# Altium schematic sheet WikiTFT-2.0.SchDoc
size A4
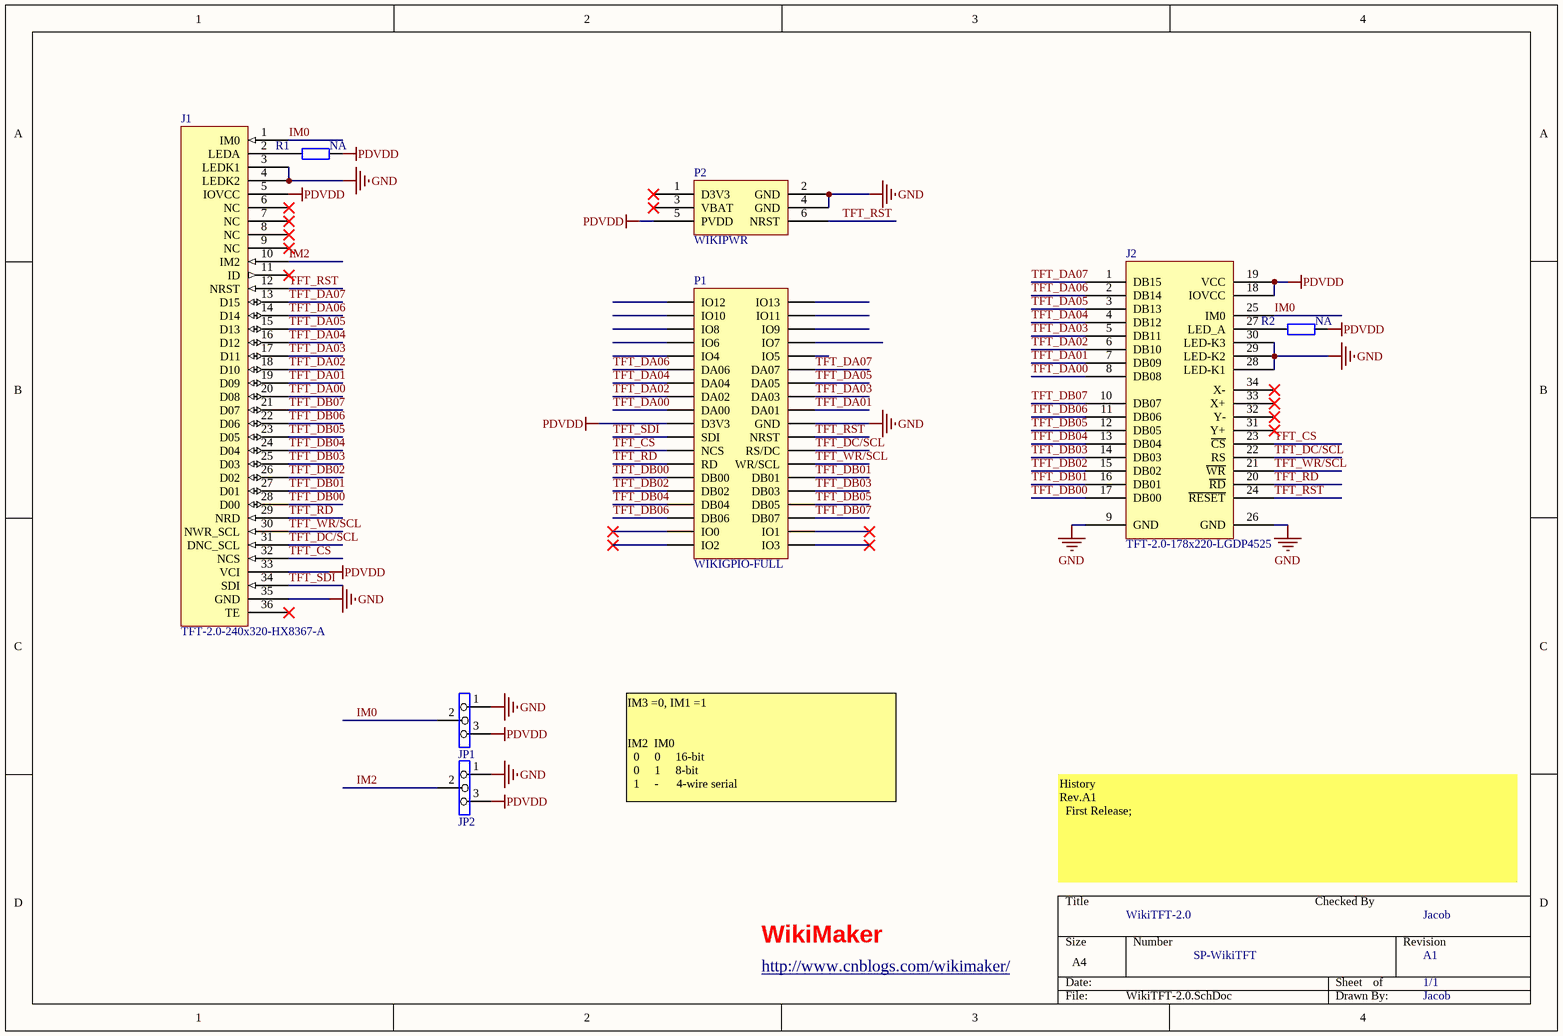
[diagram p0: WikiTFT-2.0.SchDoc]

## Parts
J1  TFT-2.0-240x320-HX8367-A  [TFT-2.0-HX8637]
J2  TFT-2.0-178x220-LGDP4525  [TFT-2.0-LGDP4525]
JP1  Jumper3  [JUMPER3_SMD]  (value not drawn)
JP2  Jumper3  [JUMPER3_SMD]  (value not drawn)
P1  WIKIGPIO-FULL  [WIKIGPIO-FULL]
P2  WIKIPWR  [WIKIPWR]
R1  NA  [0603M]
R2  NA  [0603M]

## Nets
GND: J1.3(LEDK1) J1.4(LEDK2) J1.35(GND) J2.9(GND) J2.26(GND) J2.28(LED-K1) J2.29(LED-K2) J2.30(LED-K3) JP1.1 JP2.1 P1.20(GND) P2.2(GND) P2.4(GND)
PDVDD: J1.5(IOVCC) J1.33(VCI) J2.18(IOVCC) J2.19(VCC) JP1.3 JP2.3 P1.19(D3V3) P2.5(PVDD) R1.2 R2.2
IM0: J1.1(IM0) J2.25(IM0) JP1.2
IM2: J1.10(IM2) JP2.2
TFT_CS: J1.32(NCS) J2.23(~{CS}) P1.23(NCS)
TFT_DA00: J1.20(D08) J2.8(DB08) P1.17(DA00)
TFT_DA01: J1.19(D09) J2.7(DB09) P1.18(DA01)
TFT_DA02: J1.18(D10) J2.6(DB10) P1.15(DA02)
TFT_DA03: J1.17(D11) J2.5(DB11) P1.16(DA03)
TFT_DA04: J1.16(D12) J2.4(DB12) P1.13(DA04)
TFT_DA05: J1.15(D13) J2.3(DB13) P1.14(DA05)
TFT_DA06: J1.14(D14) J2.2(DB14) P1.11(DA06)
TFT_DA07: J1.13(D15) J2.1(DB15) P1.12(DA07)
TFT_DB00: J1.28(D00) J2.17(DB00) P1.27(DB00)
TFT_DB01: J1.27(D01) J2.16(DB01) P1.28(DB01)
TFT_DB02: J1.26(D02) J2.15(DB02) P1.29(DB02)
TFT_DB03: J1.25(D03) J2.14(DB03) P1.30(DB03)
TFT_DB04: J1.24(D04) J2.13(DB04) P1.31(DB04)
TFT_DB05: J1.23(D05) J2.12(DB05) P1.32(DB05)
TFT_DB06: J1.22(D06) J2.11(DB06) P1.33(DB06)
TFT_DB07: J1.21(D07) J2.10(DB07) P1.34(DB07)
TFT_DC/SCL: J1.31(DNC_SCL) J2.22(RS) P1.24(RS/DC)
TFT_RD: J1.29(NRD) J2.20(~{RD}) P1.25(RD)
TFT_RST: J1.12(NRST) J2.24(~{RESET}) P1.22(NRST) P2.6(NRST)
TFT_SDI: J1.34(SDI) P1.21(SDI)
TFT_WR/SCL: J1.30(NWR_SCL) J2.21(~{WR}) P1.26(WR/SCL)
NetJ1_2: J1.2(LEDA) R1.1
NetJ2_27: J2.27(LED_A) R2.1

Not connected (* = marked no-connect by the designer): J1 6(NC)* 7(NC)* 8(NC)* 9(NC)* 11(ID)* 36(TE)*; J2 31(Y+)* 32(Y-)* 33(X+)* 34(X-)* 35(FMARK) 36(NC); P1 1(IO12) 2(IO13) 3(IO10) 4(IO11) 5(IO8) 6(IO9) 7(IO6) 8(IO7) 9(IO4) 10(IO5) 35(IO0)* 36(IO1)* 37(IO2)* 38(IO3)*; P2 1(D3V3)* 3(VBAT)*

## Notes on the sheet
- IM3 =0, IM1 =1
  IM2  IM0
  0     0     16-bit
  0     1     8-bit
  1     -      4-wire serial
- History
  Rev.A1
  First Release;
- WikiTFT-2.0
- Checked By
- Jacob
- http://www.cnblogs.com/wikimaker/
- WikiMaker
- SP-WikiTFT
- A1
- 1/1

## Library data of the parts
J2 = TFT-2.0-178x220-LGDP4525: LGDP4525-178x220
P1 = WIKIGPIO-FULL: Header, 19-Pin, Dual row; LatestRevisionDate: 17-Jul-2002; LatestRevisionNote: Re-released for DXP Platform.; Publisher: Altium Limited
P2 = WIKIPWR: PWR HDR
R1 R2 = Res: Resistor; Published: 8-Jun-2000; LatestRevisionDate: 17-Jul-2002; LatestRevisionNote: Re-released for DXP Platform.; PackageReference: AXIAL-0.4; Publisher: Altium Limited; Value: NA